# Altium schematic sheet PowerTree.SchDoc
size A4
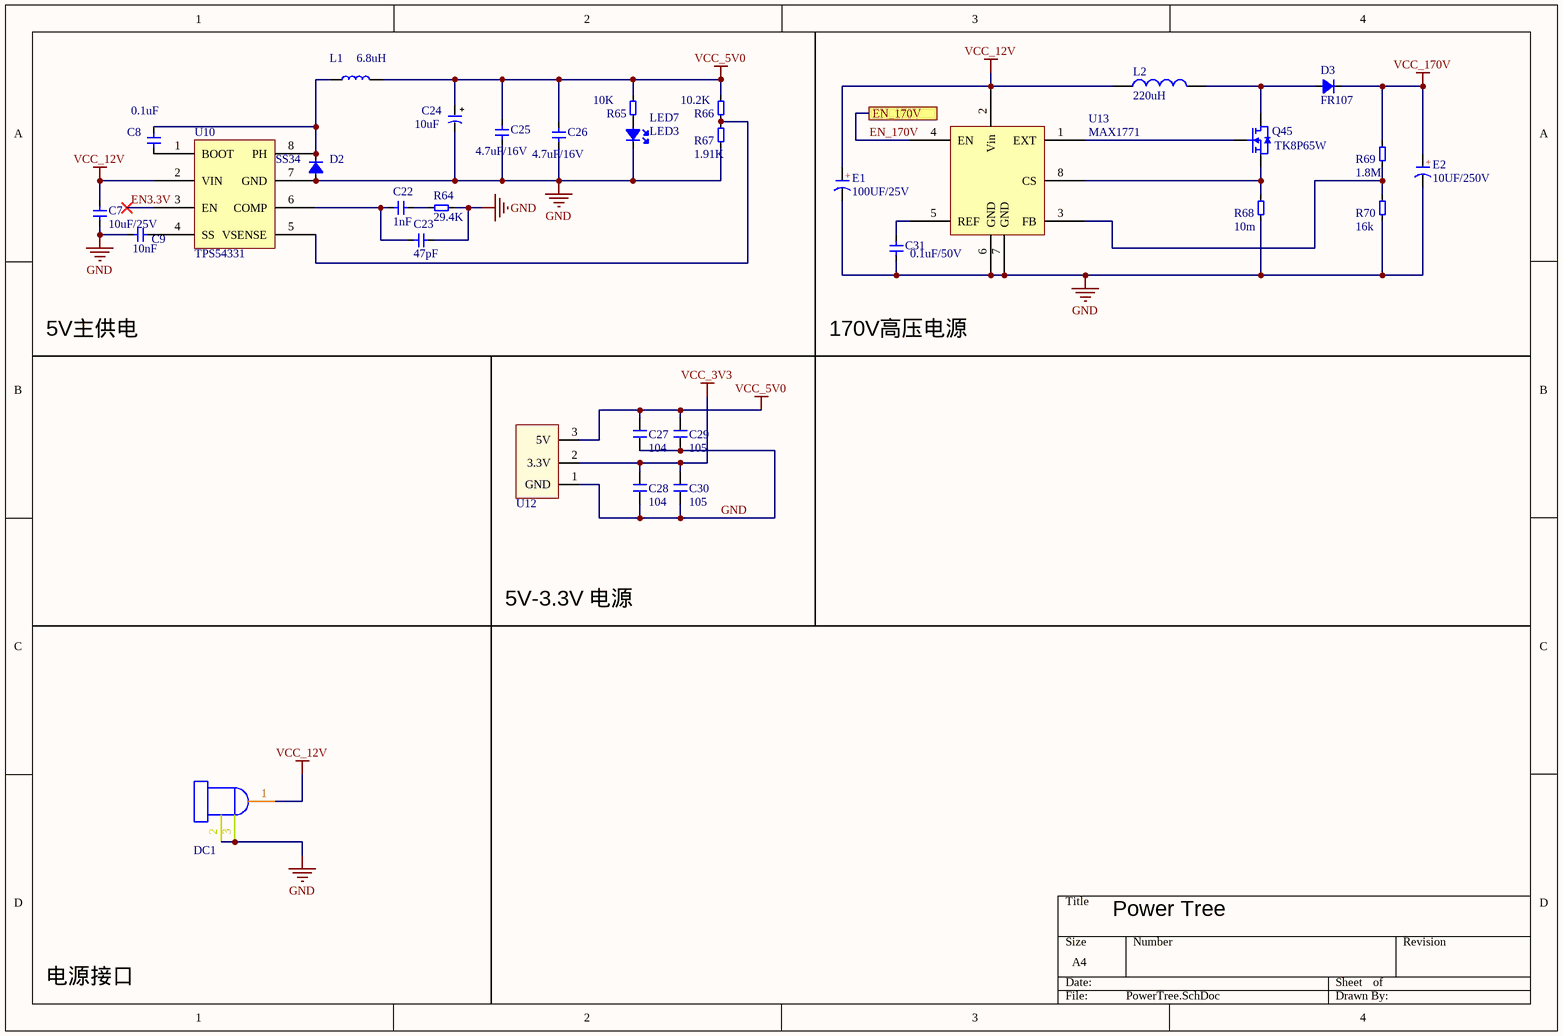
[diagram p0: PowerTree.SchDoc]

## Parts
C7  10uF/25V  [1206]
C8  0.1uF  [0603C]
C9  10nF  [0603C]
C22  1nF  [0603C]
C23  47pF  [0603C]
C24  10uF  [3528]
C25  4.7uF/16V  [0603C]
C26  4.7uF/16V  [0603C]
C27  104  [C 0805]
C28  104  [C 0805]
C29  105  [C 0805]
C30  105  [C 0805]
C31  0.1uF/50V  [0603C]
D2  SS34  [DO-214AC-SMA]
D3  FR107  [DO-214AC-SMA]
DC1  DC  [DC-005]  (value not drawn)
E1  100UF/25V  [CM D(6.3*7.7)]
E2  10UF/250V  [CM D(6.3*7.7)]
L1  6.8uH  [L100]
L2  220uH  [CDRH125]
LED7  LED3  [0603-led]
Q45  TK8P65W  [D-PAK]
R64  29.4K  [0603]
R65  10K  [0603]
R66  10.2K  [0603]
R67  1.91K  [0603]
R68  10m  [R 1206_L]
R69  1.8M  [0603]
R70  16k  [0603]
U10  TPS54331  [SO08]
U12  LM1117  [SOT223]  (value not drawn)
U13  MAX1771  [SOP8]

## Ports
EN_170V

## Nets
GND: C7.1 C9.2 C23.2 C24.2 C25.1 C26.1 C27.1 C28.1 C29.2 C30.2 C31.1 D2.1(A) DC1.2(-) DC1.3(-) E1.2(K) E2.2(K) LED7.2(K) R64.1 R67.1 R68.1 R70.1 U10.7(GND) U12.1(GND) U13.6(GND) U13.7(GND)
VCC_3V3: C28.2 C30.1 U12.2(3.3V)
VCC_5V0: C24.1 C25.2 C26.2 C27.2 C29.1 L1.1 R65.2 R66.2 U12.3(5V)
VCC_12V: C7.2 DC1.1(+) E1.1(A) L2.1 U10.2(VIN) U13.2(Vin)
VCC_170V: D3.2(K) E2.1(A) R69.2
EN3.3V: U10.3(EN)
EN_170V: U13.4(EN) ; port EN_170V
NetC8_1: C8.1 U10.1(BOOT)
NetC8_2: C8.2 D2.2(K) L1.2 U10.8(PH)
NetC9_1: C9.1 U10.4(SS)
NetC22_1: C22.1 R64.2
NetC22_2: C22.2 C23.1 U10.6(COMP)
NetC31_2: C31.2 U13.5(REF)
NetD3_1: D3.1(A) L2.2 Q45.3(D)
NetLED7_1: LED7.1(A) R65.1
NetQ45_1: Q45.1(G) U13.1(EXT)
NetQ45_2: Q45.2(S) R68.2 U13.8(CS)
NetR66_1: R66.1 R67.2 U10.5(VSENSE)
NetR69_1: R69.1 R70.2 U13.3(FB)

## Notes on the sheet
- 5V主供电
- 170V高压电源
- 5V-3.3V 电源
- Power Tree
- 电源接口
- (in symbol C-CS) +
- (in symbol CAP-+) +

## Library data of the parts
C7 C9 C23 C25 C26 C31 = CAP1: Capacitor
C8 C22 = CAP1: Capacitor; 类型: 电容
C24 = CAP-+: Capacitor
C27-C30 = C: 无极性贴片电容; 版权归属: 源创客; BOM名称: 无极性贴片电容; 学习资源: www.ooocke.com
D2 D3 = DIOLED_1: DIODE LED
E1 E2 = C-CS: 直插固态电容; 版权归属: 源创客; BOM名称: 直插固态电容; 学习资源: www.ooocke.com
L1 = INDUCTOR1_1
L2 = L: 小功率贴片电感; 版权归属: 源创客; BOM名称: 小功率贴片电感; 学习资源: www.ooocke.com
LED7 = CP_DIOLED: DIODE LED
Q45 = MOSFET-N: P-channel Enhancement Mode MOSFET; Published: 17-Sep-2003; LatestRevisionDate: 12-Dec-2006; LatestRevisionNote: IPC-7351 Footprint Added.; DatasheetVersion: Aug-1998; PackageVersion: May-1999; PackageReference: SOT23; Publisher: Altium Limited; PackageDescription: 3-Pin SOT-23 Package 0.95 mm Pitch, 2.3 mm Lead Span; ComponentLink1Description: Manufacturer Link; ComponentLink1URL: http://www.semiconductors.philips.com/; ComponentLink2Description: Datasheet; ComponentLink2URL: http://www.semiconductors.philips.com/acrobat/datasheets/BSH201_3.pdf
R64-R70 = RES2